# EAGLE design chaprintesting13viasmichael (EAGLE 6.4)
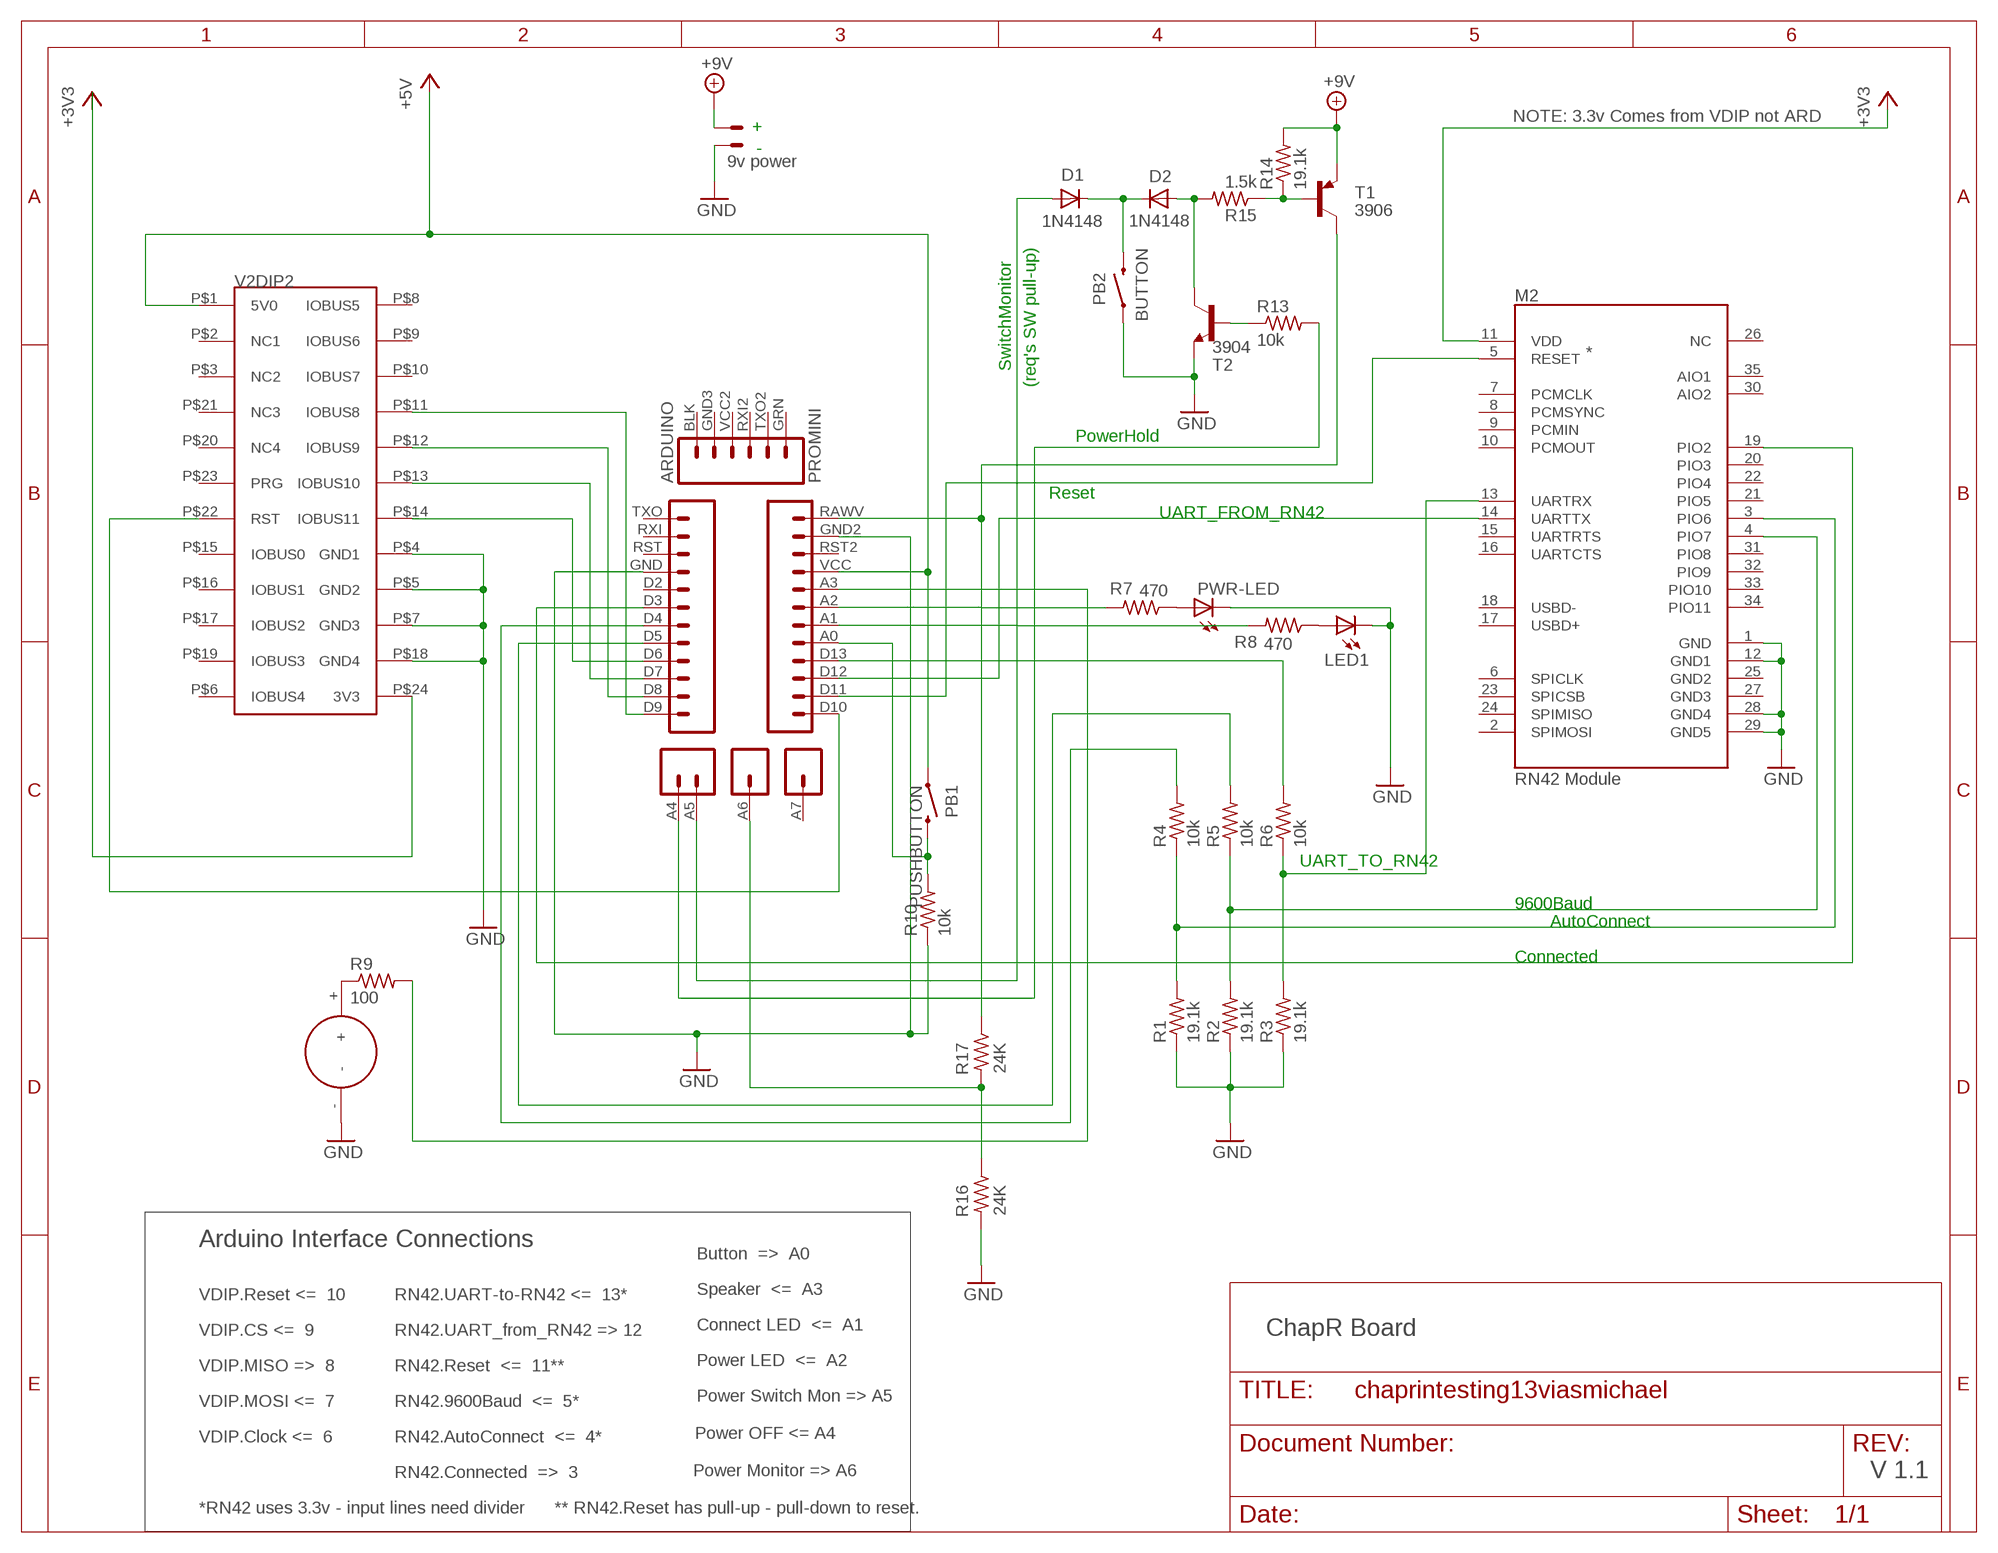
[diagram p0: schematic, sheet 1]

## Parts
-  9v power  22-23-2021  [22-23-2021]
ARDUINO  PROMINI  [PROMINI]
D1  1N4148  1N4148DO35-7  [DO35-7]
D2  1N4148  1N4148DO35-7  [DO35-7]
LED1  LED3MM  [LED3MM]
M2  RN42 Module  BLUETOOTH-RN41"  [RN41]
PB1  PUSHBUTTON  [2-PIN-PUSHBUTTON]
PB2  BUTTON  PUSHBUTTON  [2-PIN-PUSHBUTTON]
PWR-LED  LED3MM  [LED3MM]
R1  19.1k  R-US_0207/10  [0207/10]
R2  19.1k  R-US_0207/10  [0207/10]
R3  19.1k  R-US_0207/10  [0207/10]
R4  10k  R-US_0207/10  [0207/10]
R5  10k  R-US_0207/10  [0207/10]
R6  10k  R-US_0207/10  [0207/10]
R7  470  R-US_0207/10  [0207/10]
R8  470  R-US_0207/10  [0207/10]
R9  100  R-US_0207/10  [0207/10]
R10  10k  R-US_0207/10  [0207/10]
R13  10k  R-US_0207/10  [0207/10]
R14  19.1k  R-US_0207/10  [0207/10]
R15  1.5k  R-US_0207/10  [0207/10]
R16  24K  R-US_0207/10  [0207/10]
R17  24K  R-US_0207/10  [0207/10]
T1  3906  -PNP-TO92-EBC  [TO92-EBC]
T2  3904  -NPN-TO92-EBC  [TO92-EBC]
U$2  SPEAKER  [SPEAKER]
V2DIP2  V2DIP2  [V2DIP2]

## Nets
+3V3 [Supply]: M2.11(VDD)
+5V [Supply]: ARDUINO.VCC PB1.P$1 V2DIP2.P$1(5V0)
+9V [Main Supply]: -.2 R14.2 T1.E
GND [GND]: -.1 ARDUINO.GND ARDUINO.GND2 LED1.K(C) M2.1(GND) M2.12(GND1) M2.28(GND4) M2.29(GND5) PB2.P$1 PWR-LED.K(C) R1.1 R2.1 R3.1 R10.1 R16.2 T2.E U$2.- V2DIP2.P$4(GND1) V2DIP2.P$5(GND2) V2DIP2.P$7(GND3) V2DIP2.P$18(GND4)
N$1: R14.1 R15.1 T1.B
N$2: ARDUINO.D10 V2DIP2.P$22(RST)
N$3: ARDUINO.D13 R6.2
N$4: ARDUINO.D12 M2.14(UARTTX)
N$5: ARDUINO.D11 M2.5(RESET)
N$6: M2.3(PIO6) R1.2 R4.1
N$7: M2.4(PIO7) R2.2 R5.1
N$8: ARDUINO.D5 R5.2
N$9: M2.13(UARTRX) R3.2 R6.1
N$10: ARDUINO.D6 V2DIP2.P$14(IOBUS11)
N$11: ARDUINO.D7 V2DIP2.P$13(IOBUS10)
N$12: ARDUINO.D8 V2DIP2.P$12(IOBUS9)
N$13: ARDUINO.D9 V2DIP2.P$11(IOBUS8)
N$14: ARDUINO.D4 R4.2
N$15: ARDUINO.D3 M2.19(PIO2)
N$16: PWR-LED.A R7.1
N$17: LED1.A R8.1
N$18: ARDUINO.A2 R7.2
N$19: R9.1 U$2.+
N$20: ARDUINO.A1 R8.2
N$21: ARDUINO.A3 R9.2
N$23 [Main Supply]: ARDUINO.RAWV R17.1 T1.C
N$24: ARDUINO.A0 PB1.P$2 R10.2
N$25: D2.A R15.2 T2.C
N$26: R13.1 T2.B
N$27: D1.C D2.C PB2.P$2
N$28: V2DIP2.P$24(3V3)
N$29: ARDUINO.A5 D1.A
N$30: ARDUINO.A4 R13.2
N$31: ARDUINO.A6 R16.1 R17.2
Unconnected: ARDUINO.A7 ARDUINO.BLK ARDUINO.D2 ARDUINO.GND3 ARDUINO.GRN ARDUINO.RST ARDUINO.RST2 ARDUINO.RXI ARDUINO.RXI2 ARDUINO.TXO ARDUINO.TXO2 ARDUINO.VCC2 M2.2(SPIMOSI) M2.6(SPICLK) M2.7(PCMCLK) M2.8(PCMSYNC) M2.9(PCMIN) M2.10(PCMOUT) M2.15(UARTRTS) M2.16(UARTCTS) M2.17(USBD+) M2.18(USBD-) M2.20(PIO3) M2.21(PIO5) M2.22(PIO4) M2.23(SPICSB) M2.24(SPIMISO) M2.25(GND2) M2.26(NC) M2.27(GND3) M2.30(AIO2) M2.31(PIO8) M2.32(PIO9) M2.33(PIO10) M2.34(PIO11) M2.35(AIO1) V2DIP2.P$2(NC1) V2DIP2.P$3(NC2) V2DIP2.P$6(IOBUS4) V2DIP2.P$8(IOBUS5) V2DIP2.P$9(IOBUS6) V2DIP2.P$10(IOBUS7) V2DIP2.P$15(IOBUS0) V2DIP2.P$16(IOBUS1) V2DIP2.P$17(IOBUS2) V2DIP2.P$19(IOBUS3) V2DIP2.P$20(NC4) V2DIP2.P$21(NC3) V2DIP2.P$23(PRG)

## Notes on the sheet
- + | NOTE: 3.3v Comes from VDIP not ARD
- -
- *
- SwitchMonitor
- (req's SW pull-up)
- PowerHold
- Reset
- UART_FROM_RN42
- UART_TO_RN42
- 9600Baud
- AutoConnect
- Connected
- Arduino Interface Connections
- Button  =>  A0
- Speaker  <=  A3
- VDIP.Reset <=  10 | RN42.UART-to-RN42 <=  13*
- Connect LED  <=  A1
- VDIP.CS <=  9 | RN42.UART_from_RN42 => 12 | ChapR Board
- Power LED  <=  A2
- VDIP.MISO =>  8 | RN42.Reset  <=  11**
- Power Switch Mon => A5
- VDIP.MOSI <=  7 | RN42.9600Baud  <=  5*
- VDIP.Clock <=  6 | RN42.AutoConnect  <=  4* | Power OFF <= A4
- RN42.Connected  =>  3 | Power Monitor => A6 | V 1.1
- *RN42 uses 3.3v - input lines need divider | ** RN42.Reset has pull-up - pull-down to reset.

## Library data of the parts
- = con-molex:22-23-2021: .100" (2.54mm) Center Header - 2 Pin; MF: MOLEX; MPN: 22-23-2021; OC_FARNELL: 1462926; OC_NEWARK: 25C3832
ARDUINO = ChapR-Custom:PROMINI
D1 D2 = diode:1N4148: DIODE high speed (Philips)
LED1 PWR-LED = led:LED: LED OSRAM: - CHIPLED LG R971, LG N971, LY N971, LG Q971, LY Q971, LO R971, LY R971 LH N974, LH R974 LS Q976, LO Q976, LY Q976 LO Q996 - Hyper CHIPLED LW Q18S LB Q993, LB Q99A, LB R99A - SideLED LS A670, LO A670, LY A670, LG A670, LP A670 LB A673, LV A673, LT A673, LW A673 LH A674 LY A675 LS A676, LA A676, LO A676, LY A676, LW A676 LS A679, LY A679, LG A679 - Hyper Micro SIDELED® LS Y876, LA Y876, LO Y876, LY Y876 LT Y87S - SmartLED LW L88C, LW L88S LB L89C, LB L89S, LG L890 LS L89K, LO L89K, LY L89K LS L896, LA L896, LO L896, LY L896 - TOPLED LS T670, LO T670, LY T670, LG T670, LP T670 LSG T670, LSP T670, LSY T670, LOP T670, LYG T670 LG T671, LOG T671, LSG T671 LB T673, LV T673, LT T673, LW T673 LH T674 LS T676, LA T676, LO T676, LY T676, LB T676, LH T676, LSB T676, LW T676 LB T67C, LV T67C, LT T67C, LS T67K, LO T67K, LY T67K, LW E67C LS E67B, LA E67B, LO E67B, LY E67B, LB E67C, LV E67C, LT E67C LW T67C LS T679, LY T679, LG T679 LS T770, LO T770, LY T770, LG T770, LP T770 LB T773, LV T773, LT T773, LW T773 LH T774 LS E675, LA E675, LY E675, LS T675 LS T776, LA T776, LO T776, LY T776, LB T776 LHGB T686 LT T68C, LB T68C - Hyper Mini TOPLED® LB M676 - Mini TOPLED Santana® LG M470 LS M47K, LO M47K, LY M47K Source: http://www.osram.convergy.de LUXEON: - LUMILED® LXK2-PW12-R00, LXK2-PW12-S00, LXK2-PW14-U00, LXK2-PW14-V00 LXK2-PM12-R00, LXK2-PM12-S00, LXK2-PM14-U00 LXK2-PE12-Q00, LXK2-PE12-R00, LXK2-PE12-S00, LXK2-PE14-T00, LXK2-PE14-U00 LXK2-PB12-K00, LXK2-PB12-L00, LXK2-PB12-M00, LXK2-PB14-N00, LXK2-PB14-P00, LXK2-PB14-Q00 LXK2-PR12-L00, LXK2-PR12-M00, LXK2-PR14-Q00, LXK2-PR14-R00 LXK2-PD12-Q00, LXK2-PD12-R00, LXK2-PD12-S00 LXK2-PH12-R00, LXK2-PH12-S00 LXK2-PL12-P00, LXK2-PL12-Q00, LXK2-PL12-R00 Source: www.luxeon.com KINGBRIGHT: KA-3528ASYC Source: www.kingbright.com
M2 = SparkFun-RF:BLUETOOTH-RN41: Bluetooth SMD module
PB1 PB2 = ChapR-Custom:PUSHBUTTON
R1-R10 R13-R17 = resistor:R-US_: RESISTOR, American symbol
T1 = transistor-neu-to92:*-PNP-: PNP Transistror
T2 = transistor-neu-to92:*-NPN-: NPN Transistror
U$2 = ChapR-Custom:SPEAKER
V2DIP2 = ChapR-Custom:V2DIP2

## Net classes
0 default: width 0.381 mm
1 GND: width 0.635 mm
2 Supply: width 0.635 mm
3 Main Supply: width 0.635 mm

## Board
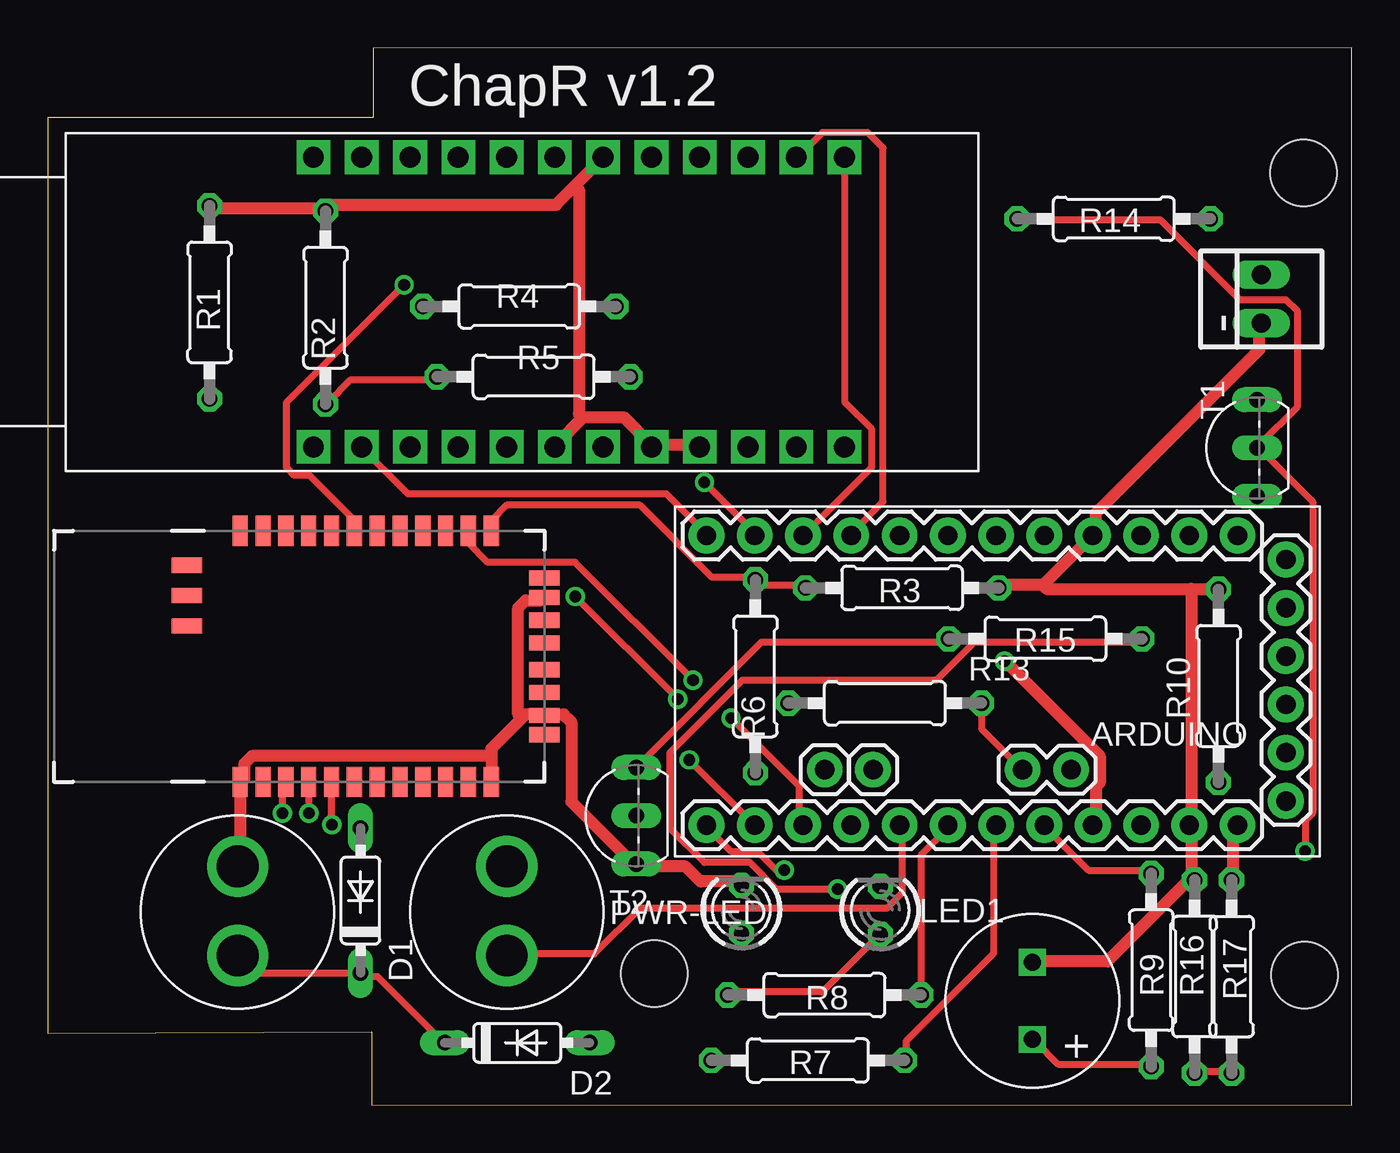
[diagram p1: board, top side]
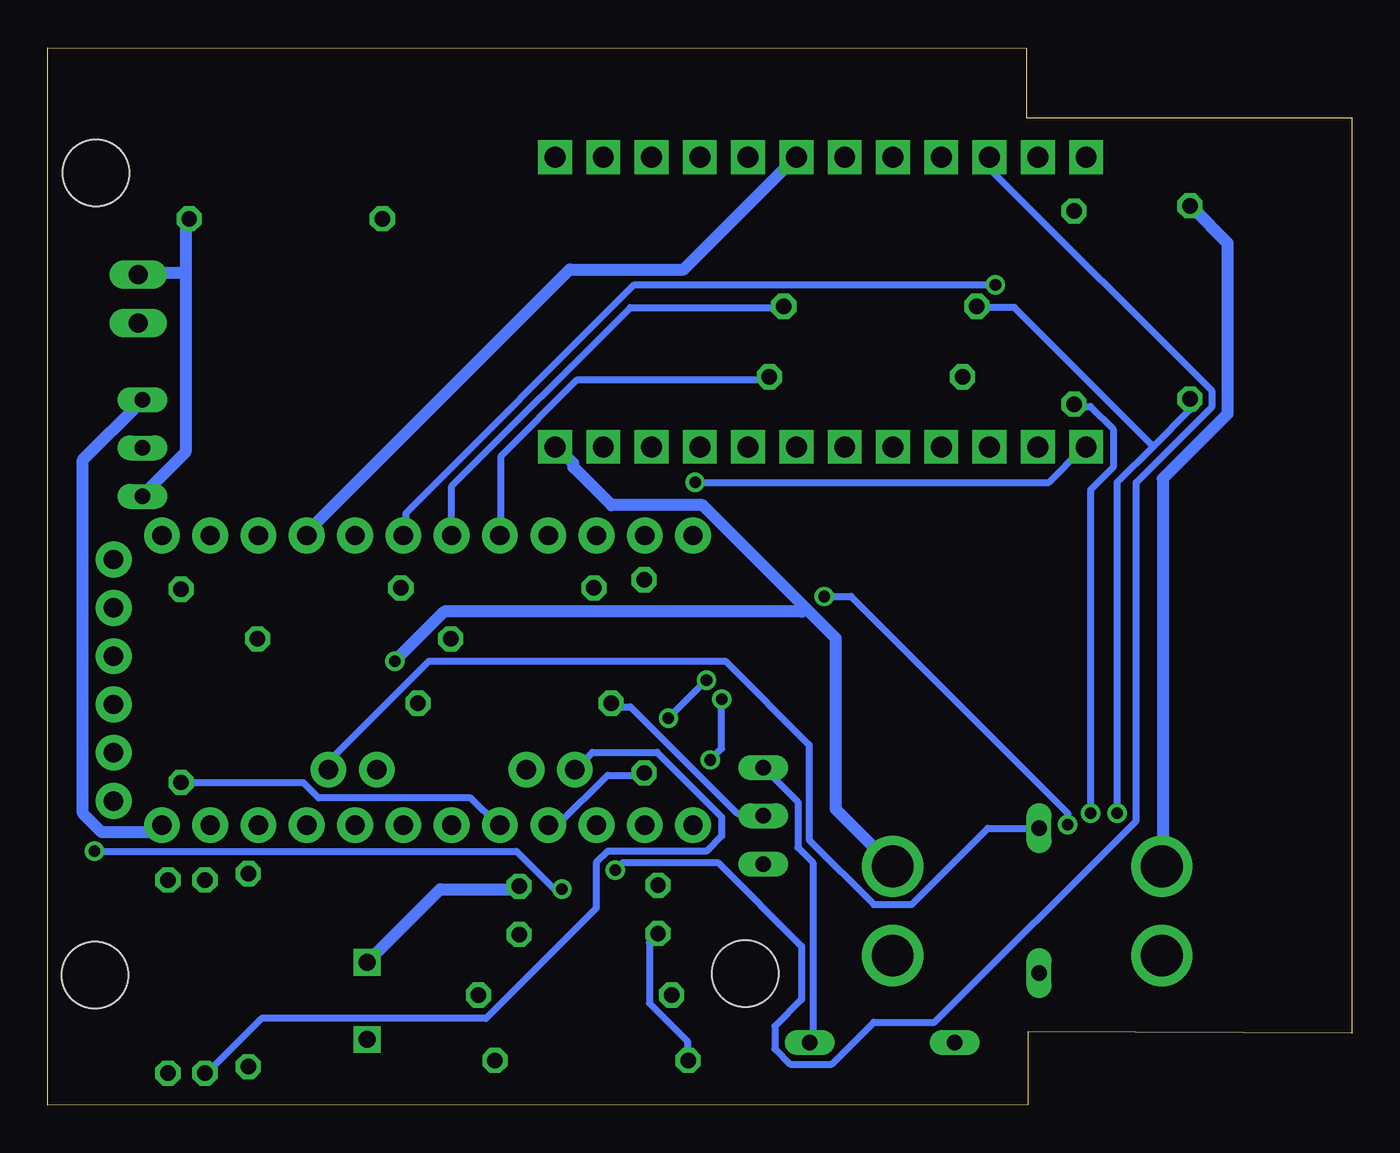
[diagram p2: board, bottom side, seen from below]

Size 68.62 x 55.65 mm. Coordinates in mm from the lower left corner, seen from the top.
Outline: 0,3.79 17.05,3.86 17.05,0.03 68.62,0 68.61,55.65 17.13,55.6 17.13,51.97 0,51.97 0,3.79
Copper layers (1*16): Top 0.035mm / dielectric 1.5mm / Bottom 0.035mm
Design rules "default *": minimum track width 10mil, minimum drill 24mil, track to track 8mil, track to pad 8mil, pad to pad 8mil, via to via 9mil, smd to smd 9mil, copper to edge 40mil, drill to drill 8mil, minimum pad ring 10mil, minimum via ring 8mil, stop-mask expansion 4mil, vias tented up to drill 0mil, thermal gap 10mil
Holes 3.5 mm at 66.08,49.05 66.11,6.84 31.92,6.94
tRestrict: area 24.4,28.8 to 26.9,31.3; area 24.3,16 to 26.8,18.5; area -0.7,15.9 to 9.5,31.2; area 30,4.9 to 34,8.9; area 64.1,4.8 to 68.1,8.8; area 64.2,47.1 to 68.2,51.1
bRestrict: area 24.4,28.8 to 26.9,31.3; area 24.3,16 to 26.8,18.5; area -0.7,16 to 9.5,31.3; area 64,4.8 to 68.2,8.8; area 64.2,47.2 to 68.3,51.1; area 29.9,5 to 34,8.9
vRestrict: area 9.5,17.4 to 25.5,29.4

### Footprints (pad centres in the part's own frame; a part is rotated, then mirrored left to right if it is on the bottom)
22-23-2021 = drill 1 long: 1 -1.27,0; 2 1.27,0
PROMINI = drill 1.016 pad 1.88: A0 6.35,-5.08; A1 6.35,-2.54; A2 6.35,0; A3 6.35,2.54; A4 3.429,1.397; A5 3.429,3.937; A6 3.429,-9.017; A7 3.429,-6.477; BLK -7.62,15.24; D2 -8.89,2.54; D3 -8.89,0; D4 -8.89,-2.54; D5 -8.89,-5.08; D6 -8.89,-7.62; D7 -8.89,-10.16; D8 -8.89,-12.7; D9 -8.89,-15.24; D10 6.35,-15.24; D11 6.35,-12.7; D12 6.35,-10.16; D13 6.35,-7.62; GND -8.89,5.08; GND2 6.35,10.16; GND3 -5.08,15.24; GRN 5.08,15.24; RAWV 6.35,12.7; RST -8.89,7.62; RST2 6.35,7.62; RXI -8.89,10.16; RXI2 0,15.24; TXO -8.89,12.7; TXO2 2.54,15.24; VCC 6.35,5.08; VCC2 -2.54,15.24
DO35-7 = drill 0.813 long: A 3.81,0; C -3.81,0
LED3MM = drill 0.813 octagon: A -1.27,0; K 1.27,0
RN41 = smd 0.8 x 1.6: 1 -6.6,-6.6; 2 -5.4,-6.6; 3 -4.2,-6.6; 4 -3,-6.6; 5 -1.8,-6.6; 6 -0.6,-6.6; 7 0.6,-6.6; 8 1.8,-6.6; 9 3,-6.6; 10 4.2,-6.6; 11 5.4,-6.6; 12 6.6,-6.6; 13 6.6,6.6; 14 5.4,6.6; 15 4.2,6.6; 16 3,6.6; 17 1.8,6.6; 18 0.6,6.6; 19 -0.6,6.6; 20 -1.8,6.6; 21 -3,6.6; 22 -4.2,6.6; 23 -5.4,6.6; 24 -6.6,6.6 | smd 1.6 x 0.8: 25 -9.4,4.8; 26 -9.4,3.2; 27 -9.4,1.6; 28 9.4,3.1; 29 9.4,-3.1; 30 9.4,-4.122; 31 9.4,-1.9; 32 9.4,-0.7; 33 9.4,0.7; 34 9.4,1.9; 35 9.4,4.122
2-PIN-PUSHBUTTON = drill 2.2 pad 3.048: P$1 -1.778,0; P$2 2.921,0
0207/10 = drill 0.813 octagon: 1 -5.08,0; 2 5.08,0
TO92-EBC = drill 0.813 long: B 0,-1.27; C 2.54,-1.27; E -2.54,-1.27
SPEAKER = drill 0.9 square: + -2.032,0; - 2.032,0
V2DIP2 = drill 1.1 pad 1.778 square: P$1 40.97,1.27; P$2 38.43,1.27; P$3 35.89,1.27; P$4 33.35,1.27; P$5 30.81,1.27; P$6 28.27,1.27; P$7 25.73,1.27; P$8 23.19,1.27; P$9 20.65,1.27; P$10 18.11,1.27; P$11 15.57,1.27; P$12 13.03,1.27; P$13 40.97,16.51; P$14 38.43,16.51; P$15 35.89,16.51; P$16 33.35,16.51; P$17 30.81,16.51; P$18 28.27,16.51; P$19 25.73,16.51; P$20 23.19,16.51; P$21 20.65,16.51; P$22 18.11,16.51; P$23 15.57,16.51; P$24 13.03,16.51

### Placement (x,y rotation side)
-  63.84,42.42 90 top
ARDUINO  49.9,21.09 270 top
D1  16.47,10.78 90 top
D2  24.71,3.29 0 top
LED1  43.8,10.26 90 top
M2  16.74,23.62 0 top
PB1  24.16,10.8 270 top
PB2  9.99,10.8 270 top
PWR-LED  36.5,10.31 90 top
R1  8.52,42.24 270 top
R2  14.62,41.97 270 top
R3  44.95,27.22 180 top
R4  24.81,42.03 0 top
R5  25.56,38.33 0 top
R6  37.23,22.57 270 top
R7  40,2.37 0 top
R8  40.87,5.8 0 top
R9  58.06,7.11 90 top
R10  61.6,22.07 270 top
R13  44.05,21.16 0 top
R14  56.09,46.64 0 top
R15  52.49,24.54 180 top
R16  60.34,6.77 90 top
R17  62.28,6.77 270 top
T1  62.35,34.58 90 top
T2  29.7,15.24 90 top
U$2  51.8,5.5 90 top
V2DIP2  0.96,33.37 0 top

### Tracks (layer width: path | path; a pad name or v marks a point on that pad's centre or on a via)
+5V  (via drill 0.61)
  Top 0.635: v50.35,23.37 55.35,18.37 55.35,16.97 55.16,16.77 55.16,14.77 ARDUINO.VCC
  Bottom 0.635: 28.76,26.17 27.16,24.57 27.16,15.57 24.35,12.77 PB1.P$1 | 28.76,26.17 34.16,31.57 38.95,31.57 40.95,33.57 40.95,33.77 41.75,34.57 V2DIP2.P$1 | v50.35,23.37 47.75,25.97 28.95,25.97 28.76,26.17
+9V
  Bottom 0.635: 61.35,43.77 61.35,46.57 R14.2 | 61.35,43.77 61.35,34.37 63.55,32.17 T1.E | 61.35,43.77 63.75,43.77 -.2
GND
  Top 0.635: PB2.P$1 10.15,12.77 10.15,16.97 M2.1 10.36,17.17 10.36,17.97 10.76,18.37 23.35,18.37 | PWR-LED.K 36.35,11.77 34.35,11.77 33.55,12.57 31.16,12.57 T2.E 30.75,12.77 27.55,15.97 27.55,20.17 27.16,20.57 26.35,20.57 M2.29 25.95,20.57 25.16,20.57 24.95,20.37 | 23.35,18.37 23.35,18.77 24.95,20.37 | 23.35,18.37 23.35,17.17 M2.12 | M2.28 25.95,26.57 25.16,26.57 24.76,26.17 24.76,20.57 24.95,20.37 | 28.16,36.17 26.76,34.77 V2DIP2.P$7 | 28.16,36.17 30.35,36.17 31.75,34.77 V2DIP2.P$5 31.95,34.77 34.16,34.77 V2DIP2.P$4 | R1.1 8.55,47.17 14.56,47.17 R2.1 14.76,47.37 26.76,47.37 27.76,48.37 | 27.76,48.37 29.16,49.77 V2DIP2.P$18 | 28.16,36.17 27.95,36.37 27.95,48.17 27.76,48.37 | 52.35,27.37 50.16,27.37 R3.1 | 52.35,27.37 54.95,29.97 ARDUINO.GND 55.16,30.17 55.16,31.17 63.75,39.77 63.75,40.97 -.1 | 60.16,27.17 52.55,27.17 52.35,27.37 | 60.16,27.17 61.55,27.17 R10.1 | 60.16,27.17 60.16,14.97 ARDUINO.GND2 60.16,14.57 60.16,11.97 R16.2 59.95,11.77 55.75,7.57 51.95,7.57 U$2.-
  Bottom 0.635: LED1.K 43.95,11.37 47.95,11.37 51.75,7.57 U$2.- | V2DIP2.P$18 29.35,49.77 35.16,43.97 41.16,43.97 54.95,30.17 ARDUINO.GND | PB2.P$1 9.96,12.77 9.96,32.97 6.55,36.37 6.55,45.37 8.36,47.17 R1.1
N$1  (via drill 0.61)
  Top 0.381: R14.1 51.16,46.57 58.55,46.57 62.75,42.37 65.16,42.37 65.75,41.77 65.75,36.77 63.75,34.77 T1.B 63.75,34.57 66.55,31.77 66.55,15.37 66.16,14.97 v66.16,13.37 | v41.55,11.37 38.35,11.37 36.95,12.77 34.55,12.77 32.75,14.57 32.75,18.57 36.55,22.37 46.75,22.37 48.75,24.37 57.55,24.37 R15.1
  Bottom 0.381: v41.55,11.37 41.95,11.37 43.95,13.37 v66.16,13.37
N$2  (via drill 0.61)
  Top 0.381: v38.75,12.37 38.35,12.37 37.35,13.37 35.95,13.37 34.75,14.57 ARDUINO.D10
  Bottom 0.381: v38.75,12.37 38.35,12.77 33.35,12.77 28.95,8.37 28.95,5.57 30.35,4.17 30.35,2.97 29.55,2.17 27.35,2.17 25.16,4.37 21.95,4.37 11.36,14.97 11.36,32.77 7.36,36.77 7.36,37.57 18.95,49.17 18.95,49.77 V2DIP2.P$22
N$3
  Bottom 0.381: R6.2 37.35,17.37 39.16,17.37 41.75,14.77 42.16,14.77 ARDUINO.D13
N$4  (via drill 0.61)
  Top 0.381: v33.95,22.37 27.76,28.57 23.16,28.57 22.16,29.57 22.16,30.17 M2.14 | v35.95,20.37 39.55,16.77 39.55,14.77 ARDUINO.D12
  Bottom 0.381: v35.95,20.37 v33.95,22.37
N$5  (via drill 0.61)
  Top 0.381: v14.96,14.77 14.96,16.97 M2.5 | v33.16,21.37 v27.76,26.77 | v33.75,18.17 37.16,14.77 ARDUINO.D11
  Bottom 0.381: v14.96,14.77 14.96,15.37 26.35,26.77 v27.76,26.77 | v33.16,21.37 33.16,18.77 v33.75,18.17
N$6  (via drill 0.61)
  Top 0.381: v12.36,15.37 12.36,16.97 M2.3
  Bottom 0.381: v12.36,15.37 12.36,32.77 10.46,34.67 | 10.46,34.67 8.55,36.57 8.55,36.97 R1.2 | 10.46,34.67 17.76,41.97 19.55,41.97 R4.1
N$7  (via drill 0.61)
  Top 0.381: v13.76,15.37 13.76,16.97 M2.4 | R5.1 20.35,38.17 15.96,38.17 14.76,36.97 R2.2
  Bottom 0.381: v13.76,15.37 13.76,32.37 12.55,33.57 12.55,35.57 13.76,36.77 14.56,36.77 R2.2
N$8
  Bottom 0.381: R5.2 30.75,38.17 40.75,38.17 44.75,34.17 44.75,30.17 ARDUINO.D5
N$9
  Top 0.381: M2.13 23.35,30.37 23.35,30.77 24.16,31.57 31.16,31.57 34.95,27.77 37.16,27.77 R6.1 37.35,27.57 37.55,27.37 39.75,27.37 R3.2
N$10
  Top 0.381: V2DIP2.P$14 39.55,49.97 40.75,51.17 43.16,51.17 43.95,50.37 43.95,31.77 42.35,30.17 ARDUINO.D6
N$11
  Top 0.381: V2DIP2.P$13 41.95,49.77 41.95,36.97 43.35,35.57 43.35,33.57 ARDUINO.D7
N$12  (via drill 0.61)
  Top 0.381: v34.55,32.77 37.16,30.17 ARDUINO.D8
  Bottom 0.381: v34.55,32.77 15.96,32.77 14.15,34.57 V2DIP2.P$12
N$13
  Top 0.381: V2DIP2.P$11 16.55,34.57 18.95,32.17 32.55,32.17 34.55,30.17 ARDUINO.D9
N$14
  Bottom 0.381: R4.2 29.95,41.97 37.95,41.97 47.35,32.57 47.35,30.17 ARDUINO.D4
N$15  (via drill 0.61)
  Top 0.381: v18.76,43.17 12.55,36.97 12.55,33.57 12.96,33.17 13.76,33.17 15.96,30.97 15.96,30.37 M2.19
  Bottom 0.381: v18.76,43.17 37.75,43.17 49.75,31.17 49.75,30.17 ARDUINO.D3
N$16
  Bottom 0.381: R7.1 34.95,2.37 34.95,3.37 36.95,5.37 36.95,8.57 36.55,8.97 PWR-LED.A
N$17
  Top 0.381: R8.1 35.95,5.97 40.75,5.97 43.75,8.97 LED1.A
N$18
  Top 0.381: R7.2 45.16,2.37 45.16,3.37 49.75,7.97 49.75,14.57 ARDUINO.A2
N$19
  Top 0.381: R9.1 57.95,2.17 53.16,2.17 51.95,3.37 U$2.+
N$20
  Top 0.381: R8.2 45.95,5.97 45.95,13.17 47.35,14.57 ARDUINO.A1
N$21
  Top 0.381: R9.2 57.95,12.37 54.75,12.37 52.55,14.57 ARDUINO.A3
N$23
  Top 0.635: R17.1 62.36,11.97 62.36,14.37 62.55,14.57 ARDUINO.RAWV
  Bottom 0.635: T1.C 63.75,36.97 66.75,33.97 66.75,15.37 65.75,14.37 62.95,14.37 62.75,14.57 ARDUINO.RAWV
N$24
  Top 0.381: PB1.P$2 24.35,7.97 28.76,7.97 31.16,10.37 44.16,10.37 44.95,11.17 44.95,14.57 ARDUINO.A0
  Bottom 0.381: R10.2 61.55,16.97 55.16,16.97 54.35,16.17 46.35,16.17 44.95,14.77 ARDUINO.A0
N$25
  Top 0.381: R15.2 47.35,24.37 37.55,24.37 31.16,17.97 T2.C
  Bottom 0.381: D2.A 28.35,3.37 28.35,12.77 29.16,13.57 29.16,15.97 30.95,17.77 T2.C
N$26
  Bottom 0.381: T2.B 31.16,15.37 32.35,15.37 37.95,20.97 38.95,20.97 R13.1
N$27
  Top 0.381: D2.C 20.76,3.37 17.35,6.77 16.55,6.77 D1.C 16.35,6.97 10.96,6.97 10.15,7.77 PB2.P$2
N$29
  Bottom 0.381: D1.A 16.55,14.57 19.16,14.57 23.16,10.57 25.16,10.57 28.55,13.97 28.55,18.97 32.95,23.37 48.55,23.37 53.75,18.17 53.75,17.77 ARDUINO.A5
N$30
  Top 0.381: R13.2 49.16,20.97 49.16,19.77 51.16,17.77 ARDUINO.A4
N$31
  Top 0.381: R16.1 60.35,1.77 62.16,1.77 R17.2
  Bottom 0.381: R16.1 60.16,1.77 57.35,4.57 45.55,4.57 39.75,10.37 39.75,12.77 39.16,13.37 33.95,13.37 33.16,14.17 33.16,15.17 36.55,18.57 39.95,18.57 40.75,17.77 ARDUINO.A6

### Text on the board
tPlace: ChapR v1.2 | +
Reference: .26 inner support diam | .32 outer support diam | 2.4 max board width | 1.94 between outer supports edge